# EAGLE design Board V.1 (EAGLE 5.06)
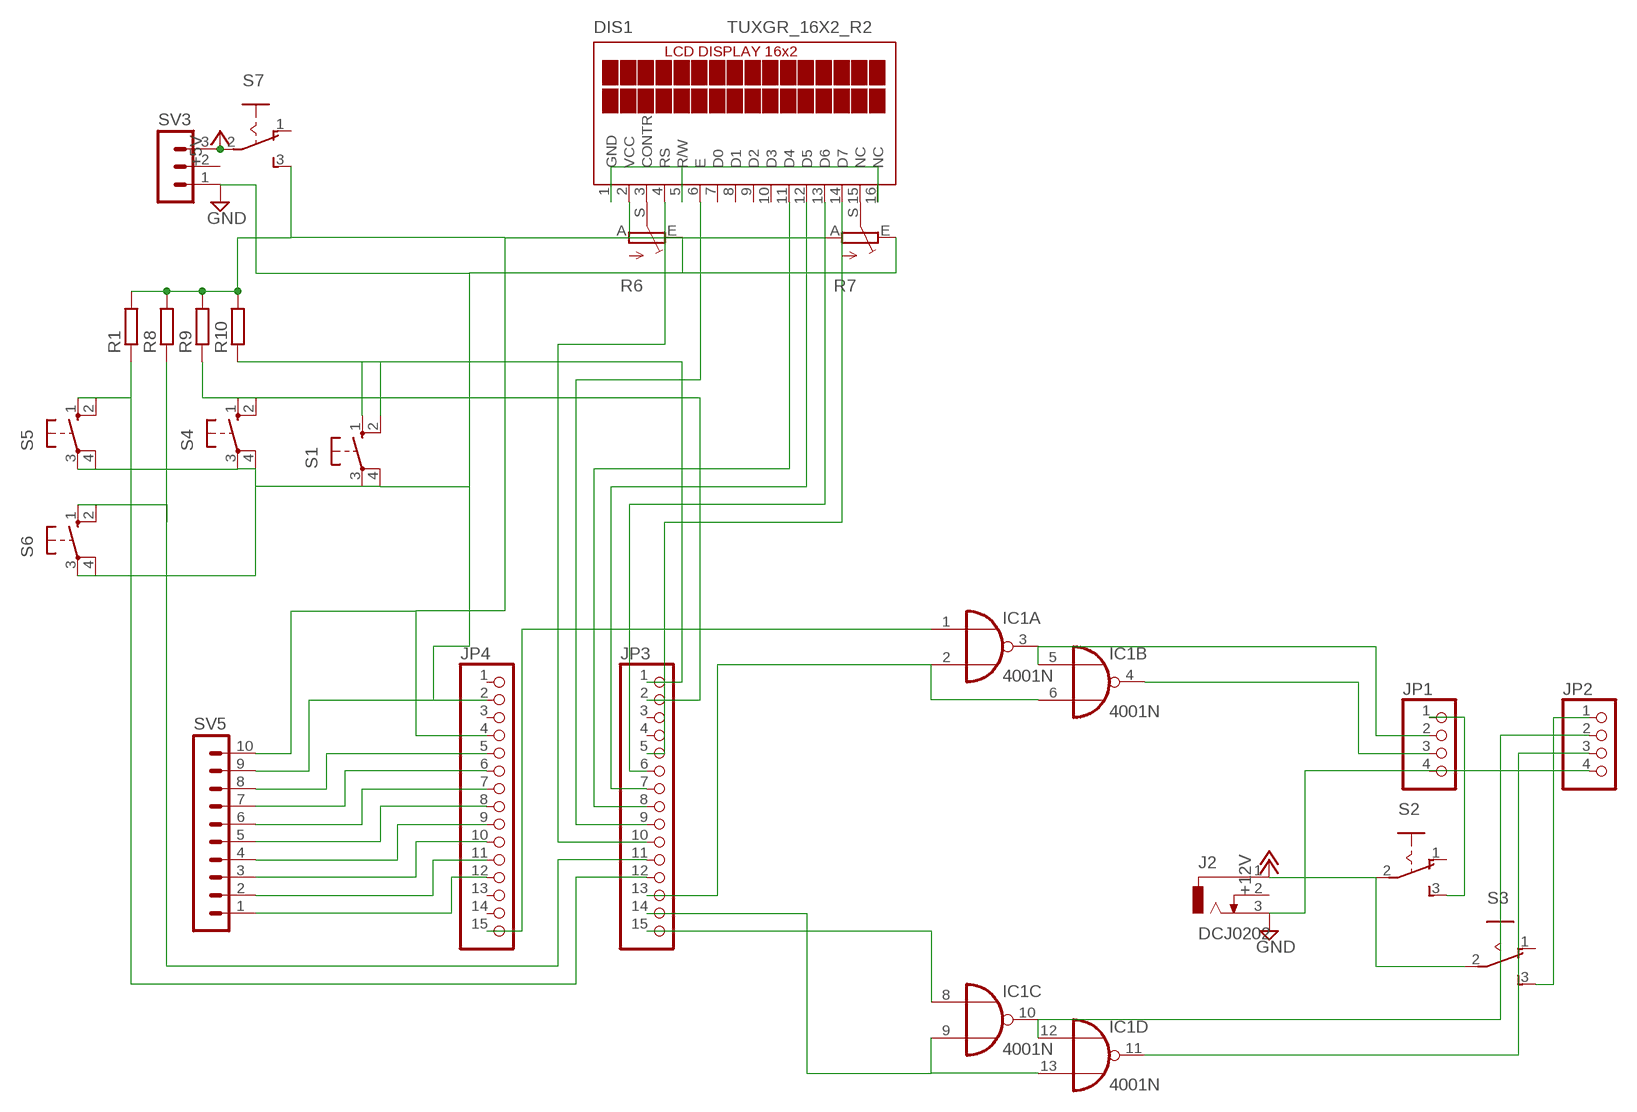
[diagram p0: schematic, sheet 1]

## Parts
DIS1  TUXGR_16X2_R2  [TUXGR_16X2_R2]
IC1  4001N  [DIL14]
J2  DCJ0202  [DCJ0202]
JP1  PINHD-1X4  [1X04]
JP2  PINHD-1X4  [1X04]
JP3  PINHD-1X15  [1X15]
JP4  PINHD-1X15  [1X15]
R1  R-EU_0204/7  [0204/7]
R6  TRIM_EU-B25P  [B25P]
R7  TRIM_EU-B25P  [B25P]
R8  R-EU_0204/7  [0204/7]
R9  R-EU_0204/7  [0204/7]
R10  R-EU_0204/7  [0204/7]
S1  10-XX  [B3F-10XX]
S2  255SB  [255SB]
S3  255SB  [255SB]
S4  10-XX  [B3F-10XX]
S5  10-XX  [B3F-10XX]
S6  10-XX  [B3F-10XX]
S7  255SB  [255SB]
SV3  MA03-1  [MA03-1]
SV5  MA10-1  [MA10-1]

## Nets
+5V: S7.2(P) SV3.3
+5V2: DIS1.2(VCC) JP4.4 R1.2 R6.A R7.A R8.2 R9.2 R10.2 S7.3(S) SV5.10
+12V: J2.1 S2.2(P) S3.2(P)
GND: J2.3 JP1.4 JP2.4 JP4.2 R6.E R7.E S1.3(P) S1.4(P1) S4.3(P) S4.4(P1) S5.3(P) S5.4(P1) S6.3(P) S6.4(P1) SV3.1 SV5.9
N$1: JP1.1 S2.3(S)
N$2: JP2.1 S3.3(S)
N$3: IC1.4(B:O) JP1.3
N$4: IC1.1(A:I0) JP4.15
N$6: IC1.11(D:O) JP2.3
N$7: JP3.1 R10.1 S1.1(S) S1.2(S1)
N$9: DIS1.15(NC) R7.S
N$10: IC1.10(C:O) IC1.12(D:I0) JP2.2
N$11: DIS1.4(RS) JP3.10
N$12: IC1.8(C:I0) JP3.15
N$13: DIS1.3(CONTR) R6.S
N$14: DIS1.6(E) JP3.9
N$15: IC1.3(A:O) IC1.5(B:I0) JP1.2
N$16: DIS1.11(D4) JP3.8
N$23: JP4.5 SV5.8
N$24: JP4.6 SV5.7
N$25: JP4.7 SV5.6
N$26: JP4.8 SV5.5
N$27: JP4.9 SV5.4
N$28: DIS1.12(D5) JP3.7
N$29: DIS1.13(D6) JP3.6
N$30: DIS1.14(D7) JP3.5
N$32: JP3.2 R9.1 S4.1(S) S4.2(S1)
N$33: JP3.11 R8.1 S6.1(S) S6.2(S1)
N$34: JP3.12 R1.1 S5.1(S) S5.2(S1)
N$36: DIS1.1(GND) DIS1.5(R/W) DIS1.16(NC)
N$40: IC1.2(A:I1) IC1.6(B:I1) JP3.13
N$45: IC1.9(C:I1) IC1.13(D:I1) JP3.14
N$46: JP4.10 SV5.3
N$47: JP4.11 SV5.2
N$49: JP4.12 SV5.1
Unconnected: DIS1.7(D0) DIS1.8(D1) DIS1.9(D2) DIS1.10(D3) J2.2 JP3.3 JP3.4 JP4.1 JP4.3 JP4.13 JP4.14 S2.1(O) S3.1(O) S7.1(O) SV3.2

## Power pins joined to a net without a drawn wire
+5V: IC1.14(P:VDD)
GND: IC1.7(P:VSS)

## Library data of the parts
DIS1 = display-lcd:TUXGR_16X2_R2: Tuxgraphics LCD display 16x2 characters reflective, without background light Source: tuxgr_12x2_r2.pdf
IC1 = 40xx:4001: Quad 2-input NOR
J2 = con-jack:DCJ0202: DC POWER JACK Source: DCJ0202.pdf
JP1 JP2 = pinhead:PINHD-1X4: PIN HEADER
JP3 JP4 = pinhead:PINHD-1X15: PIN HEADER
R1 R8-R10 = resistor:R-EU_: RESISTOR, European symbol
R6 R7 = pot:TRIM_EU-: POTENTIOMETER
S1 S4-S6 = switch-omron:10-XX: OMRON SWITCH
S2 S3 S7 = switch:255SB: SLIDING SWITCH Distributor Buerklin, 11G810
SV3 = con-lstb:MA03-1: PIN HEADER
SV5 = con-lstb:MA10-1: PIN HEADER

## Net classes
0 default: width 0.051 mm, clearance 0.051 mm

## Board
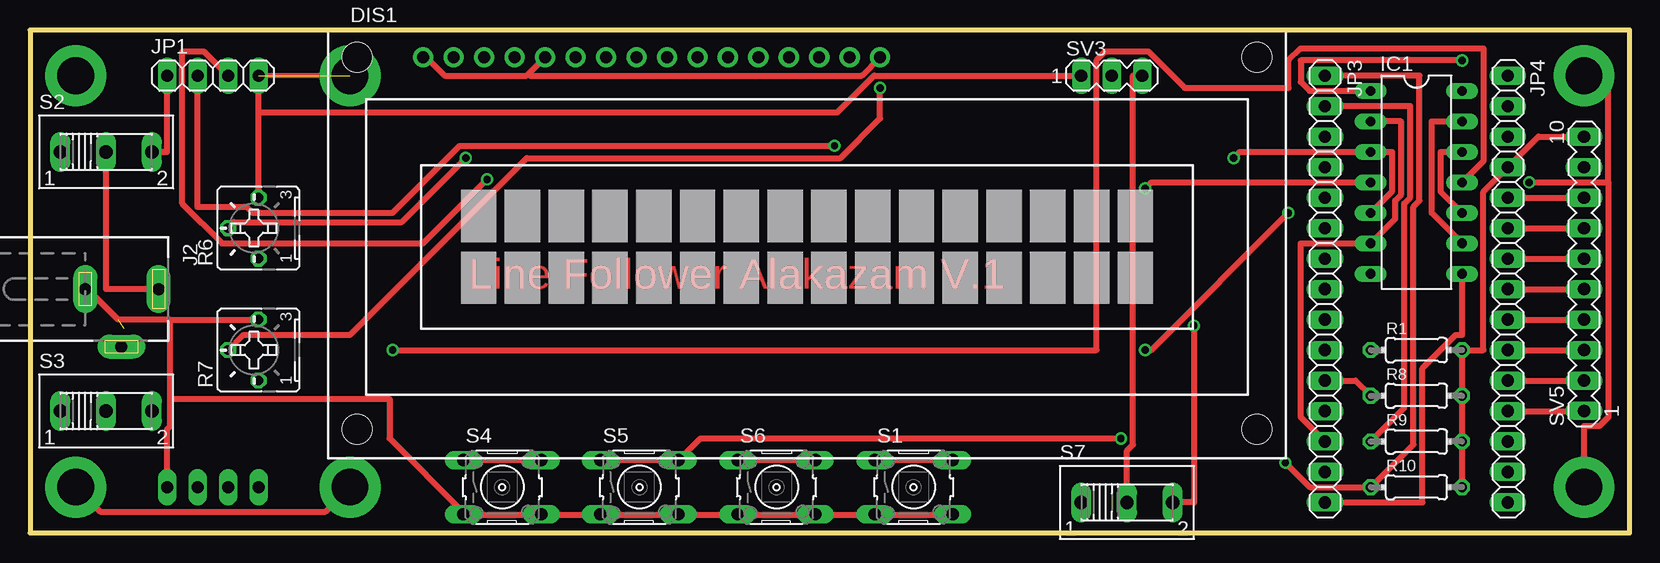
[diagram p1: board, top side]
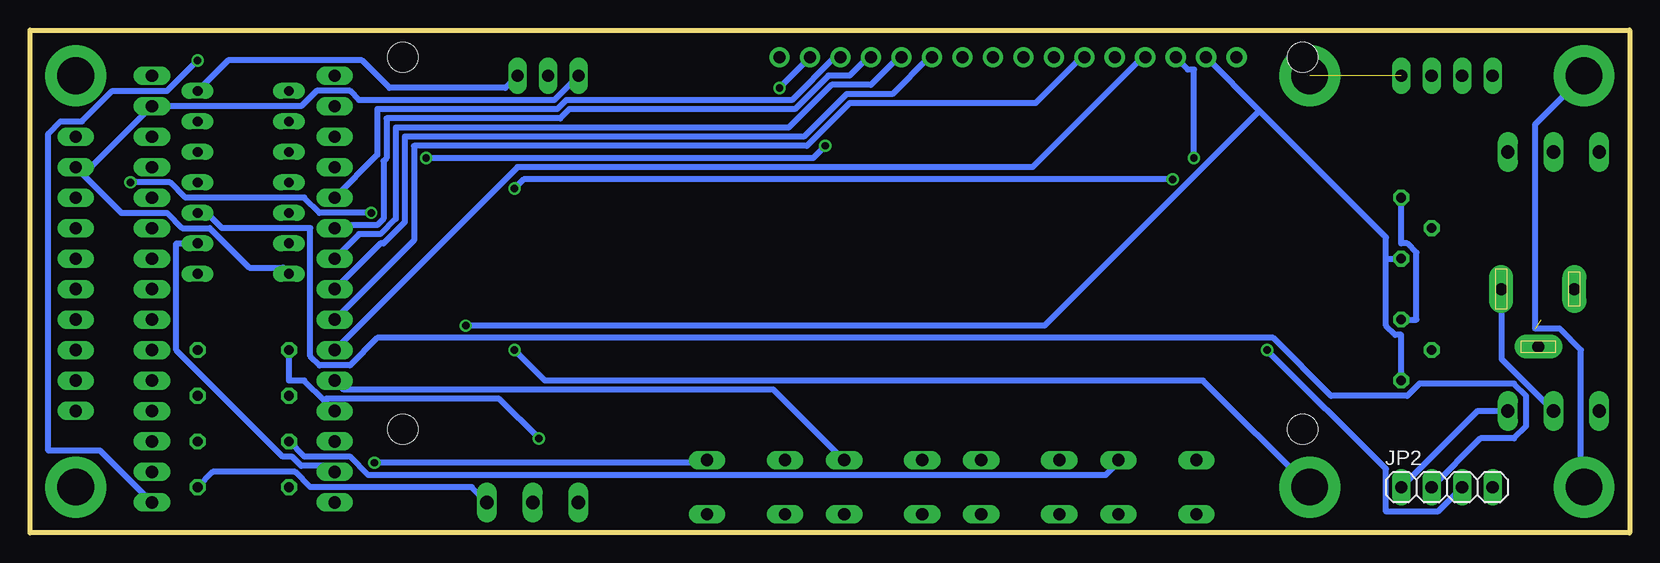
[diagram p2: board, bottom side, seen from below]

Size 133.35 x 41.91 mm. Coordinates in mm from the lower left corner, seen from the top.
Outline: 133.35,41.91 0,41.91 0,0 133.35,0 133.35,41.91
Copper layers (1*16): Top 0.035mm / dielectric 1.5mm / Bottom 0.035mm
Design rules "default *": minimum track width 20mil, minimum drill 24mil, track to track 8mil, track to pad 8mil, pad to pad 8mil, via to via 8mil, smd to smd 8mil, copper to edge 40mil, drill to drill 8mil, minimum pad ring 10mil, minimum via ring 8mil, stop-mask expansion 4mil, vias tented up to drill 0mil, thermal gap 10mil

### Footprints (pad centres in the part's own frame; a part is rotated, then mirrored left to right if it is on the bottom)
TUXGR_16X2_R2 = drill 1 pad 1.676 round: 1 -32,15.5; 2 -29.46,15.5; 3 -26.92,15.5; 4 -24.38,15.5; 5 -21.84,15.5; 6 -19.3,15.5; 7 -16.76,15.5; 8 -14.22,15.5; 9 -11.68,15.5; 10 -9.14,15.5; 11 -6.6,15.5; 12 -4.06,15.5; 13 -1.52,15.5; 14 1.02,15.5; 15 3.56,15.5; 16 6.1,15.5 | hole 2.5: -37.5,-15.5; 37.5,-15.5; -37.5,15.5; 37.5,15.5
DIL14 = drill 0.813 long: 1 -7.62,-3.81; 2 -5.08,-3.81; 3 -2.54,-3.81; 4 0,-3.81; 5 2.54,-3.81; 6 5.08,-3.81; 7 7.62,-3.81; 8 7.62,3.81; 9 5.08,3.81; 10 2.54,3.81; 11 0,3.81; 12 -2.54,3.81; 13 -5.08,3.81; 14 -7.62,3.81
DCJ0202 = drill 1 pad 2 long: 1 0,3.1; 2 4.8,0; 3 0,-3
1X04 = drill 1.016 long: 1 -3.81,0; 2 -1.27,0; 3 1.27,0; 4 3.81,0
1X15 = drill 1.016 long: 1 -17.78,0; 2 -15.24,0; 3 -12.7,0; 4 -10.16,0; 5 -7.62,0; 6 -5.08,0; 7 -2.54,0; 8 0,0; 9 2.54,0; 10 5.08,0; 11 7.62,0; 12 10.16,0; 13 12.7,0; 14 15.24,0; 15 17.78,0
0204/7 = drill 0.813 octagon: 1 -3.81,0; 2 3.81,0
B25P = drill 0.813 octagon: A -2.54,0; E 2.54,0; S 0,2.54
B3F-10XX = drill 1.016 long: 1 -3.251,2.261; 2 3.251,2.261; 3 -3.251,-2.261; 4 3.251,-2.261
255SB = drill 1.118 long: 1 -3.81,0; 2 0,0; 3 3.81,0
MA03-1 = drill 1.016 long: 1 -2.54,0; 2 0,0; 3 2.54,0
MA10-1 = drill 1.016 long: 1 -11.43,0; 2 -8.89,0; 3 -6.35,0; 4 -3.81,0; 5 -1.27,0; 6 1.27,0; 7 3.81,0; 8 6.35,0; 9 8.89,0; 10 11.43,0

### Placement (x,y rotation side)
DIS1  64.77,24.13 0 top
IC1  115.57,29.21 270 top
J2  7.62,20.32 270 top
JP1  15.24,38.1 0 top
JP2  15.24,3.81 0 bottom
JP3  107.95,20.32 270 top
JP4  123.19,20.32 270 top
R1  115.57,15.24 0 top
R6  19.05,25.4 90 top
R7  19.05,15.24 90 top
R8  115.57,11.43 0 top
R9  115.57,7.62 0 top
R10  115.57,3.81 0 top
S1  73.66,3.81 0 top
S2  6.35,31.75 0 top
S3  6.35,10.16 0 top
S4  39.37,3.81 0 top
S5  50.8,3.81 0 top
S6  62.23,3.81 0 top
S7  91.44,2.54 0 top
SV3  90.17,38.1 0 top
SV5  129.54,21.59 90 top

### Tracks (layer width: path | path; a pad name or v marks a point on that pad's centre or on a via)
+5V
  Top 0.508: S7.2 91.44,6.86 91.95,7.37 91.95,38.1 SV3.3
  Bottom 0.508: IC1.14 116.84,39.37 105.66,39.37 103.38,37.08 93.73,37.08 SV3.3
+5V2  (via drill 0.61)
  Top 0.508: SV5.10 125.73,33.02 JP4.4 121.16,28.45 121.16,15.24 R1.2 R8.2 R9.2 R10.2 | v97.03,17.27 97.03,2.54 S7.3
  Bottom 0.508: R7.A 19.05,16.51 19.56,16.51 20.32,17.27 20.32,22.86 | 20.32,22.86 R6.A | 30.86,35.18 20.32,24.64 20.32,22.86 | 30.86,35.18 DIS1.2 | S7.3 96.52,3.81 109.98,3.81 111.25,5.08 118.11,5.08 R10.2 | v97.03,17.27 48.77,17.27 30.86,35.18
+12V
  Top 0.508: S2.2 6.35,20.32 J2.1
  Bottom 0.508: S3.2 10.67,14.48 10.67,20.32 J2.1
GND  (via drill 0.61, 3.05 pad 5.08)  (2 unrouted)
  Top 0.406: v26.67,38.1 JP1.4
  Top 0.508: S1.4 76.71,1.52 70.61,1.52 S1.3 70.36,1.52 65.53,1.52 S6.4 65.28,1.52 59.18,1.52 S6.3 58.93,1.52 54.1,1.52 S5.4 53.85,1.52 47.75,1.52 S5.3 47.5,1.52 42.67,1.52 S4.4 42.42,1.52 36.32,1.52 S4.3 36.07,1.78 29.97,7.87 29.97,11.18 11.68,11.18 | 19.05,35.05 JP1.4 | R6.E 19.05,35.05 | 11.68,17.78 7.37,17.78 4.83,20.32 J2.3 | 11.68,17.78 R7.E | JP2.4 11.43,8.64 11.68,8.89 11.68,11.18 | 11.68,11.18 11.68,17.78 | SV3.1 70.36,38.1 67.31,35.05 19.05,35.05 | v129.54,3.81 129.54,8.89 130.81,8.89 131.57,9.65 131.57,29.21 | 131.57,29.21 131.57,38.1 v129.54,38.1 | v3.81,3.81 5.84,1.78 24.64,1.78 v26.67,3.81 | v124.97,29.21 131.57,29.21 | v104.9,26.67 93.47,15.24 v92.96,15.24
  Bottom 0.508: IC1.7 112.27,22.1 115.06,22.1 118.36,25.4 120.65,25.4 121.92,26.67 125.73,26.67 SV5.9 128.78,29.97 JP4.2 110.74,35.56 109.47,36.83 106.68,36.83 105.92,36.07 89.66,36.07 SV3.1 | R6.E 19.05,24.13 18.54,24.13 17.78,23.37 17.78,17.78 R7.E | v3.81,38.1 7.87,34.04 7.87,17.02 5.84,17.02 4.06,15.24 4.06,3.81 v3.81,3.81 | v124.97,29.21 121.67,29.21 120.4,27.94 110.49,27.94 109.22,26.67 v104.9,26.67 | v92.96,15.24 90.42,12.7 35.56,12.7 v26.67,3.81
N$1
  Top 0.508: JP1.1 11.43,31.75 S2.3
N$2
  Bottom 0.508: JP2.1 12.7,10.16 S3.3
N$3  (via drill 0.61)
  Top 0.508: IC1.4 93.47,29.21 v92.96,28.7 | v38.1,29.46 32.77,24.13 16,24.13 12.7,27.43 12.7,40.13 14.48,40.13 JP1.3
  Bottom 0.508: v92.96,28.7 92.2,29.46 v38.1,29.46
N$4  (via drill 0.61)
  Top 0.508: IC1.1 106.68,36.83 105.92,37.59 105.92,39.37 v119.38,39.37
  Bottom 0.508: v119.38,39.37 121.92,36.83 126.49,36.83 129.03,34.29 130.81,34.29 131.83,33.27 131.83,6.86 127.51,6.86 JP4.15
N$6  (via drill 0.61)
  Top 0.508: IC1.11 121.16,30.99 121.16,40.39 105.92,40.39 104.9,39.37 104.9,37.08 96.27,37.08 93.22,40.13 89.66,40.13 88.9,39.37 88.9,15.24 v30.23,15.24
  Bottom 0.508: v30.23,15.24 20.32,5.33 20.32,1.78 16,1.78 JP2.3
N$7  (via drill 0.61)
  Top 0.508: S1.1 70.61,6.1 76.71,6.1 S1.2 | JP3.1 115.82,38.1 115.82,27.69 115.32,27.18 115.32,7.37 R10.1 106.68,3.81 v104.65,5.84
  Bottom 0.508: v104.65,5.84 76.96,5.84 S1.2
N$9  (via drill 0.61)
  Top 0.508: R7.S 17.78,16.51 26.67,16.51 41.4,31.24 67.56,31.24 70.87,34.54 v70.87,37.08
  Bottom 0.508: v70.87,37.08 DIS1.15
N$10
  Top 0.508: IC1.10 117.6,28.45 117.6,31.75 IC1.12
  Bottom 0.508: JP2.2 12.45,7.87 9.65,7.87 8.64,8.89 8.64,11.43 9.65,12.45 17.53,12.45 18.54,11.43 24.89,11.43 29.72,16.26 104.39,16.26 106.68,13.97 109.22,13.97 109.98,14.73 109.98,25.4 117.35,25.4 118.62,26.67 IC1.10
N$11
  Bottom 0.508: JP3.10 92.71,30.48 49.78,30.48 40.64,39.62 DIS1.4
N$12
  Top 0.508: IC1.8 119.38,16.51 118.87,16.51 116.08,13.72 116.08,2.54 JP3.15
N$13  (via drill 0.61)
  Top 0.508: R6.S 17.02,25.91 30.99,25.91 v36.32,31.24
  Bottom 0.508: v36.32,31.24 36.32,38.61 36.83,38.61 DIS1.3
N$14
  Bottom 0.508: JP3.9 101.35,24.38 101.35,32.26 68.58,32.26 65.02,35.81 49.53,35.81 45.72,39.62 DIS1.6
N$15  (via drill 0.61)
  Top 0.508: IC1.5 113.54,28.45 113.54,31.75 IC1.3 100.84,31.75 v100.33,31.24 | JP1.2 13.97,27.18 18.03,27.18 18.54,26.67 30.23,26.67 35.81,32.26 v67.06,32.26
  Bottom 0.508: v67.06,32.26 68.07,31.24 v100.33,31.24
N$16
  Bottom 0.508: JP3.8 104.14,24.13 103.89,24.13 102.11,25.91 102.11,33.02 68.83,33.02 65.28,36.58 61.47,36.58 58.42,39.62 DIS1.11
N$23
  Top 0.508: JP4.5 SV5.8
N$24
  Top 0.508: JP4.6 SV5.7
N$25
  Top 0.508: JP4.7 SV5.6
N$26
  Top 0.508: JP4.8 SV5.5
N$27
  Top 0.508: JP4.9 SV5.4
N$28
  Bottom 0.508: JP3.7 105.92,24.89 104.14,24.89 102.87,26.16 102.87,33.78 70.1,33.78 66.55,37.34 63.25,37.34 60.96,39.62 DIS1.12
N$29
  Bottom 0.508: JP3.6 107.7,25.65 104.39,25.65 103.89,26.16 103.89,30.99 103.63,31.24 103.63,34.54 89.15,34.54 88.39,35.31 69.6,35.31 66.8,38.1 65.02,38.1 63.5,39.62 DIS1.13
N$30
  Bottom 0.508: JP3.5 104.39,31.5 104.39,35.31 89.41,35.31 88.65,36.07 69.85,36.07 66.29,39.62 66.04,39.62 DIS1.14
N$32
  Top 0.508: S4.1 36.32,6.1 42.42,6.1 S4.2 | R9.1 114.55,10.41 114.55,27.43 115.06,27.94 115.06,35.56 JP3.2
  Bottom 0.508: R9.1 110.49,6.35 106.68,6.35 105.16,4.83 43.69,4.83 42.67,5.84 S4.2
N$33
  Top 0.508: R8.1 110.49,12.7 JP3.11 | S6.1 59.18,6.1 65.28,6.1 S6.2
  Bottom 0.508: JP3.11 107.19,11.94 71.37,11.94 65.53,6.1 S6.2
N$34  (via drill 0.61)
  Top 0.508: S5.1 47.75,6.1 53.85,6.1 S5.2 54.1,6.1 55.88,7.87 v90.93,7.87
  Bottom 0.508: R1.1 111.76,12.7 110.49,12.7 108.84,11.05 | 108.84,11.05 JP3.12 | v90.93,7.87 94.23,11.18 108.71,11.18 108.84,11.05
N$36
  Top 0.508: 41.53,38.23 DIS1.5 | 41.53,38.23 41.4,38.1 34.54,38.1 33.02,39.62 DIS1.1 | DIS1.16 69.34,38.1 41.66,38.1 41.53,38.23
N$40
  Top 0.508: IC1.2 114.3,34.29 114.3,28.19 113.79,27.69 113.79,26.16 IC1.6 105.92,24.13 105.92,9.65 JP3.13
N$45
  Top 0.508: IC1.9 116.84,26.67 116.84,34.29 IC1.13
  Bottom 0.508: JP3.14 108.46,5.59 110.74,5.59 111.51,6.35 112.27,6.35 121.16,15.24 121.16,24.13 IC1.9
N$46
  Top 0.508: JP4.10 SV5.3
N$47
  Top 0.508: JP4.11 SV5.2
N$49
  Top 0.508: JP4.12 SV5.1

### Text on the board
Top: Line Follower Alakazam V.1